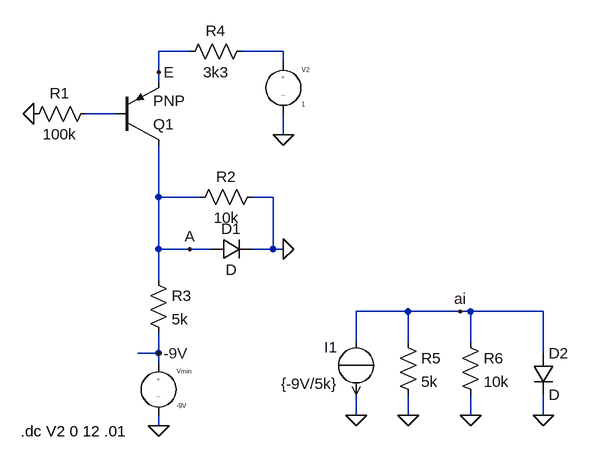
[diagram p0: schematic Draft1.asc]
Draft1.asc, the LTspice schematic file:
Version 4
SHEET 1 972 680
WIRE 336 -32 288 -32
WIRE 480 -32 416 -32
WIRE 480 -16 480 -32
WIRE 288 0 288 -32
WIRE 288 16 288 0
WIRE 224 64 176 64
WIRE 480 96 480 64
WIRE 288 192 288 112
WIRE 352 192 288 192
WIRE 464 192 432 192
WIRE 288 272 288 192
WIRE 336 272 288 272
WIRE 368 272 336 272
WIRE 464 272 464 192
WIRE 464 272 432 272
WIRE 480 272 464 272
WIRE 288 320 288 272
WIRE 672 368 592 368
WIRE 752 368 672 368
WIRE 768 368 752 368
WIRE 880 368 768 368
WIRE 592 416 592 368
WIRE 672 416 672 368
WIRE 768 416 768 368
WIRE 288 432 288 400
WIRE 288 432 256 432
WIRE 880 432 880 368
WIRE 288 448 288 432
WIRE 592 528 592 496
WIRE 672 528 672 496
WIRE 768 528 768 496
WIRE 880 528 880 496
WIRE 288 544 288 528
FLAG 288 544 0
FLAG 96 64 0
FLAG 480 96 0
FLAG 480 272 0
FLAG 288 432 -9V
FLAG 336 272 A
FLAG 288 0 E
FLAG 592 528 0
FLAG 880 528 0
FLAG 768 528 0
FLAG 672 528 0
FLAG 752 368 ai
SYMBOL source-V 288 432 R0
WINDOW 123 0 0 Left 2
WINDOW 39 0 0 Left 2
SYMATTR InstName Vmin
SYMATTR Value -9V
SYMBOL EIT_Semiconductors\\pnp 224 112 M180
SYMATTR InstName Q1
SYMBOL res 192 48 R90
WINDOW 0 0 56 VBottom 2
WINDOW 3 32 56 VTop 2
SYMATTR InstName R1
SYMATTR Value 100k
SYMBOL res 336 208 R270
WINDOW 0 32 56 VTop 2
WINDOW 3 0 56 VBottom 2
SYMATTR InstName R2
SYMATTR Value 10k
SYMBOL diode 368 288 R270
WINDOW 0 32 32 VTop 2
WINDOW 3 0 32 VBottom 2
SYMATTR InstName D1
SYMBOL source-V 480 -32 R0
WINDOW 123 0 0 Left 2
WINDOW 39 0 0 Left 2
SYMATTR InstName V2
SYMATTR Value 1
SYMBOL res 320 -16 R270
WINDOW 0 32 56 VTop 2
WINDOW 3 0 56 VBottom 2
SYMATTR InstName R4
SYMATTR Value 3k3
SYMBOL res 272 304 R0
SYMATTR InstName R3
SYMATTR Value 5k
SYMBOL source-I 592 496 R180
WINDOW 0 29 73 Left 2
WINDOW 3 29 17 Left 2
WINDOW 123 0 0 Left 2
WINDOW 39 0 0 Left 2
SYMATTR InstName I1
SYMATTR Value {-9V/5k}
SYMBOL res 656 400 R0
SYMATTR InstName R5
SYMATTR Value 5k
SYMBOL res 752 400 R0
SYMATTR InstName R6
SYMATTR Value 10k
SYMBOL diode 864 432 R0
SYMATTR InstName D2
TEXT 76 552 Left 2 !.dc V2 0 12 .01

The netlist it stands for:
* Draft1.asc
Vmin -9V 0 -9V
Q1 A N002 E 0 PNP
R1 N002 0 100k
R2 A 0 10k
D1 A 0 D
V2 N001 0 1
R4 E N001 3k3
R3 A -9V 5k
I1 ai 0 {-9V/5k}
R5 ai 0 5k
R6 ai 0 10k
D2 ai 0 D
.model D D
.lib standard.dio
.model NPN NPN
.model PNP PNP
.lib standard.bjt
.dc V2 0 12 .01
.backanno
.end